# EAGLE design bot_power_supply (EAGLE 9.6.2)
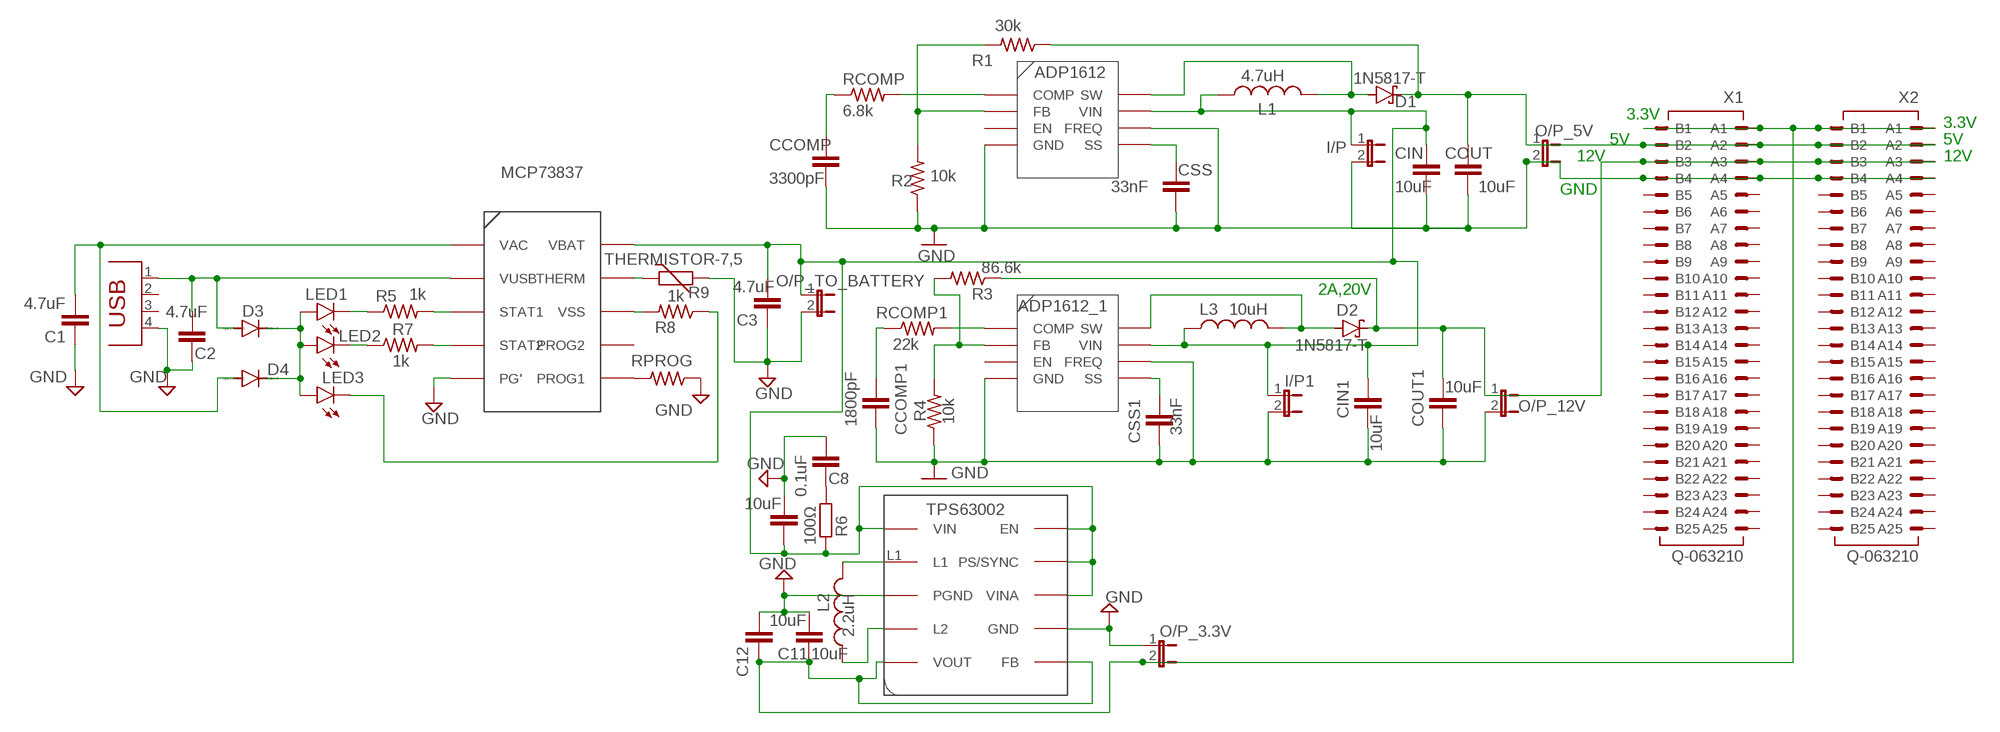
[diagram p0: schematic, sheet 1]

## Parts
ADP1612  ADP1612_DEV  [ADP1612_FOOT]
ADP1612_1  ADP1612_DEV  [ADP1612_FOOT]
C1  4.7uF  C2,5-3  [C2.5-3]
C2  4.7uF  C2,5-3  [C2.5-3]
C3  4.7uF  C2,5-3  [C2.5-3]
C8  0.1uF  C2.5/2  [C2.5-2]
C10  10uF  C2.5/2  [C2.5-2]
C11  10uF  C2.5/2  [C2.5-2]
C12  10uF  C2.5/2  [C2.5-2]
CCOMP  3300pF  C2,5-3  [C2.5-3]
CCOMP1  1800pF  C2,5-3  [C2.5-3]
CIN  10uF  C2,5-3  [C2.5-3]
CIN1  10uF  C2,5-3  [C2.5-3]
COUT  10uF  C2,5-3  [C2.5-3]
COUT1  10uF  C2,5-3  [C2.5-3]
CSS  33nF  C2,5-3  [C2.5-3]
CSS1  33nF  C2,5-3  [C2.5-3]
D1  1N5817-T  [DO41-7.6]
D2  1N5817-T  [DO41-7.6]
D3  1N4004  [DO41-10]
D4  1N4004  [DO41-10]
I/P  JP1E  [JP1]
I/P1  JP1E  [JP1]
L1  4.7uH  L-US0204/7  [0204/7]
L2  2.2uH  L-US0207/7  [0207/7]
L3  10uH  L-US0204/7  [0204/7]
LED1  LED3MM  [LED3MM]
LED2  LEDLD260  [LD260]
LED3  LED3MM  [LED3MM]
MCP73837  MCP73837-DEV  [MCP73837]
O/P_3.3V  JP1E  [JP1]
O/P_5V  JP1E  [JP1]
O/P_12V  JP1E  [JP1]
O/P_TO_BATTERY  JP1E  [JP1]
R1  30k  R-US_0204/2V  [0204V]
R2  10k  R-US_0204/2V  [0204V]
R3  86.6k  R-US_0204/2V  [0204V]
R4  10k  R-US_0204/2V  [0204V]
R5  1k  R-US_0204/2V  [0204V]
R6  100Ω  R-EU_0207/10  [0207/10]
R7  1k  R-US_0204/2V  [0204V]
R8  1k  R-US_0204/2V  [0204V]
R9  THERMISTOR-7,5  [R-7,5]
RCOMP  6.8k  R-US_0204/2V  [0204V]
RCOMP1  22k  R-US_0204/2V  [0204V]
RPROG  R-US_0204/2V  [0204V]
TPS63002  TPS63002  [TPS63002]
USB  PN61729  [PN61729]
X1  Q-063210  [063210]
X2  Q-063210  [063210]

## Nets
GND: ADP1612.FREQ ADP1612.GND ADP1612_1.FREQ ADP1612_1.GND C1.1 C2.1 C3.1 C8.2 C10.2 C11.2 C12.2 CCOMP1.2 CCOMP.2 CIN1.2 CIN.2 COUT1.2 COUT.2 CSS1.2 CSS.2 I/P1.2 I/P.2 MCP73837.PG' O/P_3.3V.1 O/P_5V.2 O/P_12V.2 O/P_TO_BATTERY.2 R2.1 R4.1 R9.2 RPROG.1 TPS63002.GND TPS63002.PGND USB.4 X1.A4 X1.B4 X2.A4 X2.B4
N$1: ADP1612.COMP RCOMP.2
N$2: CCOMP.1 RCOMP.1
N$3: COUT.1 D1.C O/P_5V.1 R1.1 X1.A2 X1.B2 X2.A2 X2.B2
N$4: ADP1612.FB R1.2 R2.2
N$5: L2.1 TPS63002.L1
N$6: ADP1612.SS CSS.1
N$7: ADP1612.SW D1.A L1.2
N$8: ADP1612_1.COMP RCOMP1.2
N$9: CCOMP1.1 RCOMP1.1
N$10: COUT1.1 D2.C O/P_12V.1 R3.1 X1.A3 X1.B3 X2.A3 X2.B3
N$11: L2.2 TPS63002.L2
N$12: ADP1612_1.FB R3.2 R4.2
N$13: ADP1612_1.SS CSS1.1
N$14: MCP73837.VSS R8.2
N$15: ADP1612_1.SW D2.A L3.2
N$16: MCP73837.STAT1 R5.2
N$17: MCP73837.STAT2 R7.2
N$19: ADP1612.VIN ADP1612_1.VIN C3.2 C10.1 CIN1.1 CIN.1 I/P1.1 I/P.1 L1.1 L3.1 MCP73837.VBAT O/P_TO_BATTERY.1 R6.1 TPS63002.EN TPS63002.PS/SYNC TPS63002.VIN TPS63002.VINA
N$20: C8.1 R6.2
N$22: MCP73837.PROG1 RPROG.2
N$23: MCP73837.THERM R9.1
N$24: C2.2 D3.A MCP73837.VUSB USB.1
N$25: LED1.K(C) R5.1
N$26: LED2.K(C) R7.1
N$27: D3.C D4.C LED1.A LED2.A LED3.A
N$28: C1.2 D4.A MCP73837.VAC
N$29: LED3.K(C) R8.1
N$30: C11.1 C12.1 O/P_3.3V.2 TPS63002.FB TPS63002.VOUT X1.A1 X1.B1 X2.A1 X2.B1
Unconnected: ADP1612.EN ADP1612_1.EN MCP73837.PROG2 USB.2 USB.3 X1.A5 X1.A6 X1.A7 X1.A8 X1.A9 X1.A10 X1.A11 X1.A12 X1.A13 X1.A14 X1.A15 X1.A16 X1.A17 X1.A18 X1.A19 X1.A20 X1.A21 X1.A22 X1.A23 X1.A24 X1.A25 X1.B5 X1.B6 X1.B7 X1.B8 X1.B9 X1.B10 X1.B11 X1.B12 X1.B13 X1.B14 X1.B15 X1.B16 X1.B17 X1.B18 X1.B19 X1.B20 X1.B21 X1.B22 X1.B23 X1.B24 X1.B25 X2.A5 X2.A6 X2.A7 X2.A8 X2.A9 X2.A10 X2.A11 X2.A12 X2.A13 X2.A14 X2.A15 X2.A16 X2.A17 X2.A18 X2.A19 X2.A20 X2.A21 X2.A22 X2.A23 X2.A24 X2.A25 X2.B5 X2.B6 X2.B7 X2.B8 X2.B9 X2.B10 X2.B11 X2.B12 X2.B13 X2.B14 X2.B15 X2.B16 X2.B17 X2.B18 X2.B19 X2.B20 X2.B21 X2.B22 X2.B23 X2.B24 X2.B25

## Notes on the sheet
- 3.3V
- 3.3V
- 5V | 5V
- 12V | 12V
- GND
- 2A,20V

## Library data of the parts
ADP1612 ADP1612_1 = ADP1612:ADP1612_DEV
C1-C3 C8 C10-C12 CCOMP CCOMP1 CIN CIN1 COUT COUT1 CSS CSS1 = capacitor-wima:C: CAPACITOR naming: grid - package width
D1 D2 = diode:1N581*: 1.0A SCHOTTKY BARRIER RECTIFIER Source: http://www.diodes.com/datasheets/ds23001.pdf
D3 D4 = diode:1N4004: DIODE general purpose rectifier, 1 A
I/P I/P1 O/P_3.3V O/P_5V O/P_12V O/P_TO_BATTERY = jumper:JP1E: JUMPER
L1-L3 = rcl:L-US: INDUCTOR, American symbol; SPICEPREFIX: L
LED1-LED3 = led:LED: LED OSRAM: - CHIPLED LG R971, LG N971, LY N971, LG Q971, LY Q971, LO R971, LY R971 LH N974, LH R974 LS Q976, LO Q976, LY Q976 LO Q996 - Hyper CHIPLED LW Q18S LB Q993, LB Q99A, LB R99A - SideLED LS A670, LO A670, LY A670, LG A670, LP A670 LB A673, LV A673, LT A673, LW A673 LH A674 LY A675 LS A676, LA A676, LO A676, LY A676, LW A676 LS A679, LY A679, LG A679 - Hyper Micro SIDELED® LS Y876, LA Y876, LO Y876, LY Y876 LT Y87S - SmartLED LW L88C, LW L88S LB L89C, LB L89S, LG L890 LS L89K, LO L89K, LY L89K LS L896, LA L896, LO L896, LY L896 - TOPLED LS T670, LO T670, LY T670, LG T670, LP T670 LSG T670, LSP T670, LSY T670, LOP T670, LYG T670 LG T671, LOG T671, LSG T671 LB T673, LV T673, LT T673, LW T673 LH T674 LS T676, LA T676, LO T676, LY T676, LB T676, LH T676, LSB T676, LW T676 LB T67C, LV T67C, LT T67C, LS T67K, LO T67K, LY T67K, LW E67C LS E67B, LA E67B, LO E67B, LY E67B, LB E67C, LV E67C, LT E67C LW T67C LS T679, LY T679, LG T679 LS T770, LO T770, LY T770, LG T770, LP T770 LB T773, LV T773, LT T773, LW T773 LH T774 LS E675, LA E675, LY E675, LS T675 LS T776, LA T776, LO T776, LY T776, LB T776 LHGB T686 LT T68C, LB T68C - Hyper Mini TOPLED® LB M676 - Mini TOPLED Santana® LG M470 LS M47K, LO M47K, LY M47K Source: http://www.osram.convergy.de LUXEON: - LUMILED® LXK2-PW12-R00, LXK2-PW12-S00, LXK2-PW14-U00, LXK2-PW14-V00 LXK2-PM12-R00, LXK2-PM12-S00, LXK2-PM14-U00 LXK2-PE12-Q00, LXK2-PE12-R00, LXK2-PE12-S00, LXK2-PE14-T00, LXK2-PE14-U00 LXK2-PB12-K00, LXK2-PB12-L00, LXK2-PB12-M00, LXK2-PB14-N00, LXK2-PB14-P00, LXK2-PB14-Q00 LXK2-PR12-L00, LXK2-PR12-M00, LXK2-PR14-Q00, LXK2-PR14-R00 LXK2-PD12-Q00, LXK2-PD12-R00, LXK2-PD12-S00 LXK2-PH12-R00, LXK2-PH12-S00 LXK2-PL12-P00, LXK2-PL12-Q00, LXK2-PL12-R00 Source: www.luxeon.com KINGBRIGHT: KA-3528ASYC Source: www.kingbright.com
MCP73837 = MCP73837:MCP73837-DEV
R1-R5 R7 R8 RCOMP RCOMP1 RPROG = rcl:R-US_: RESISTOR, American symbol; SPICEPREFIX: R
R6 = rcl:R-EU_: RESISTOR, European symbol; SPICEPREFIX: R
R9 = varistor:THERMISTOR: THERMISTOR
TPS63002 = TPS63002:TPS63002
USB = con-berg:PN61729: BERG USB connector; OC_FARNELL: unknown; OC_NEWARK: unknown
X1 X2 = con-erni:Q-063210: Male Connector SMC-Q 50 contacts Standard Assembly Height Source: http://www.erni.com/DB/PDF-Drawing/SMC/063210.pdf; OC_FARNELL: unknown; OC_NEWARK: unknown

## Board
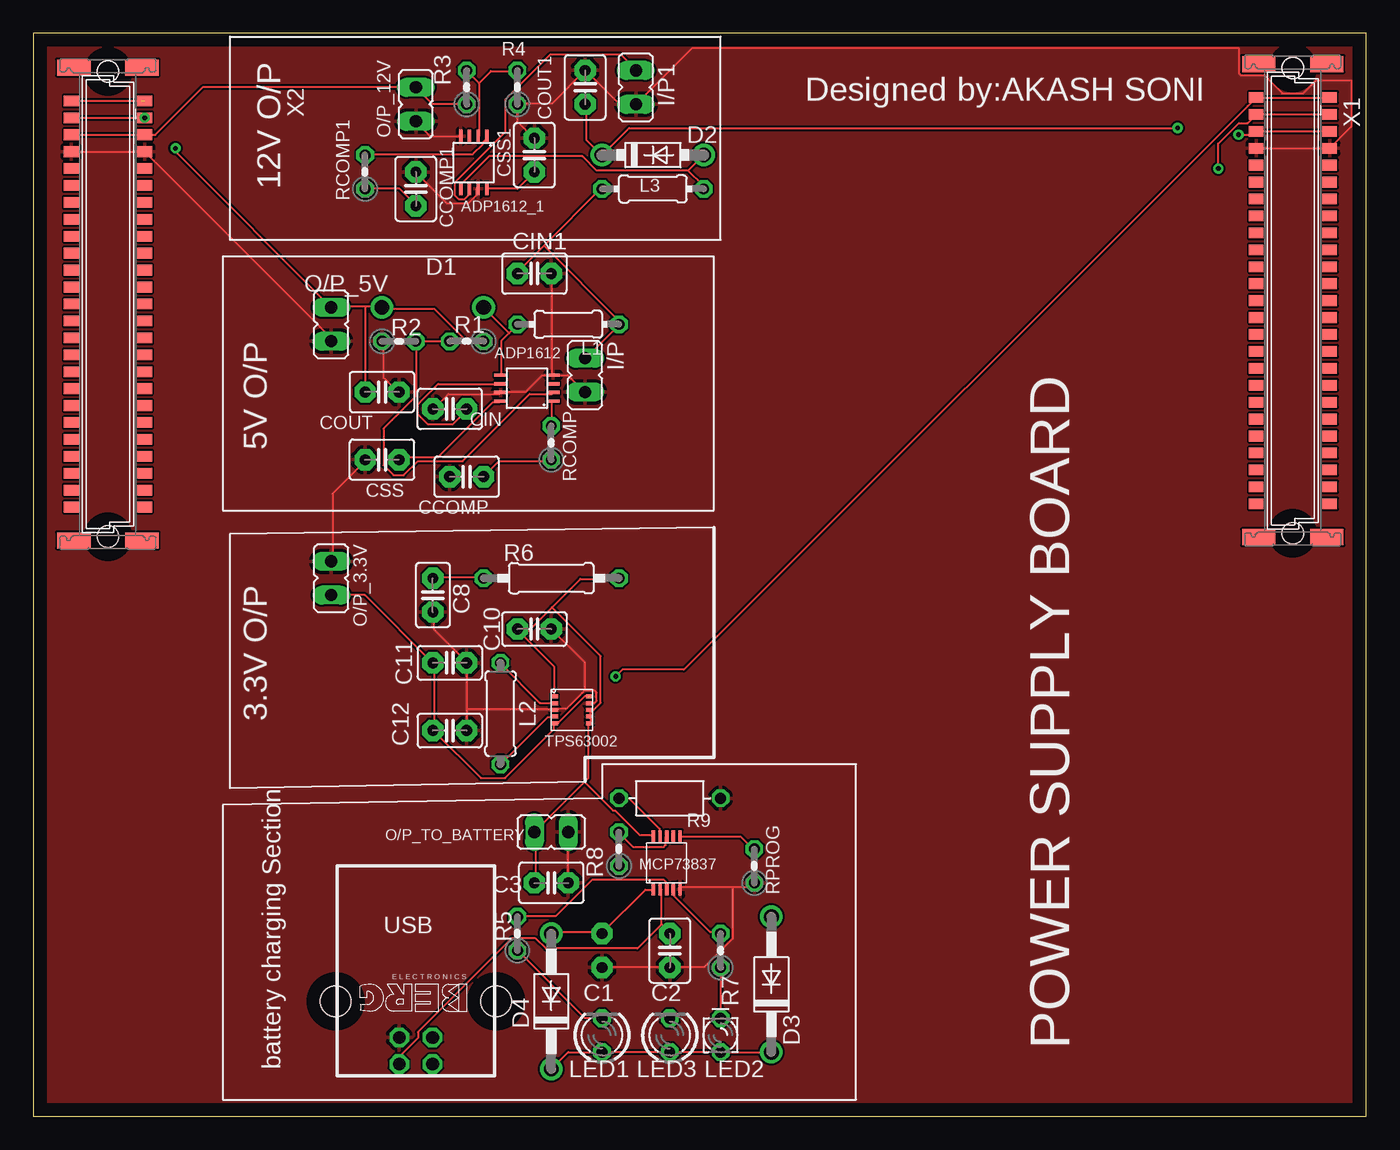
[diagram p1: board, top side]
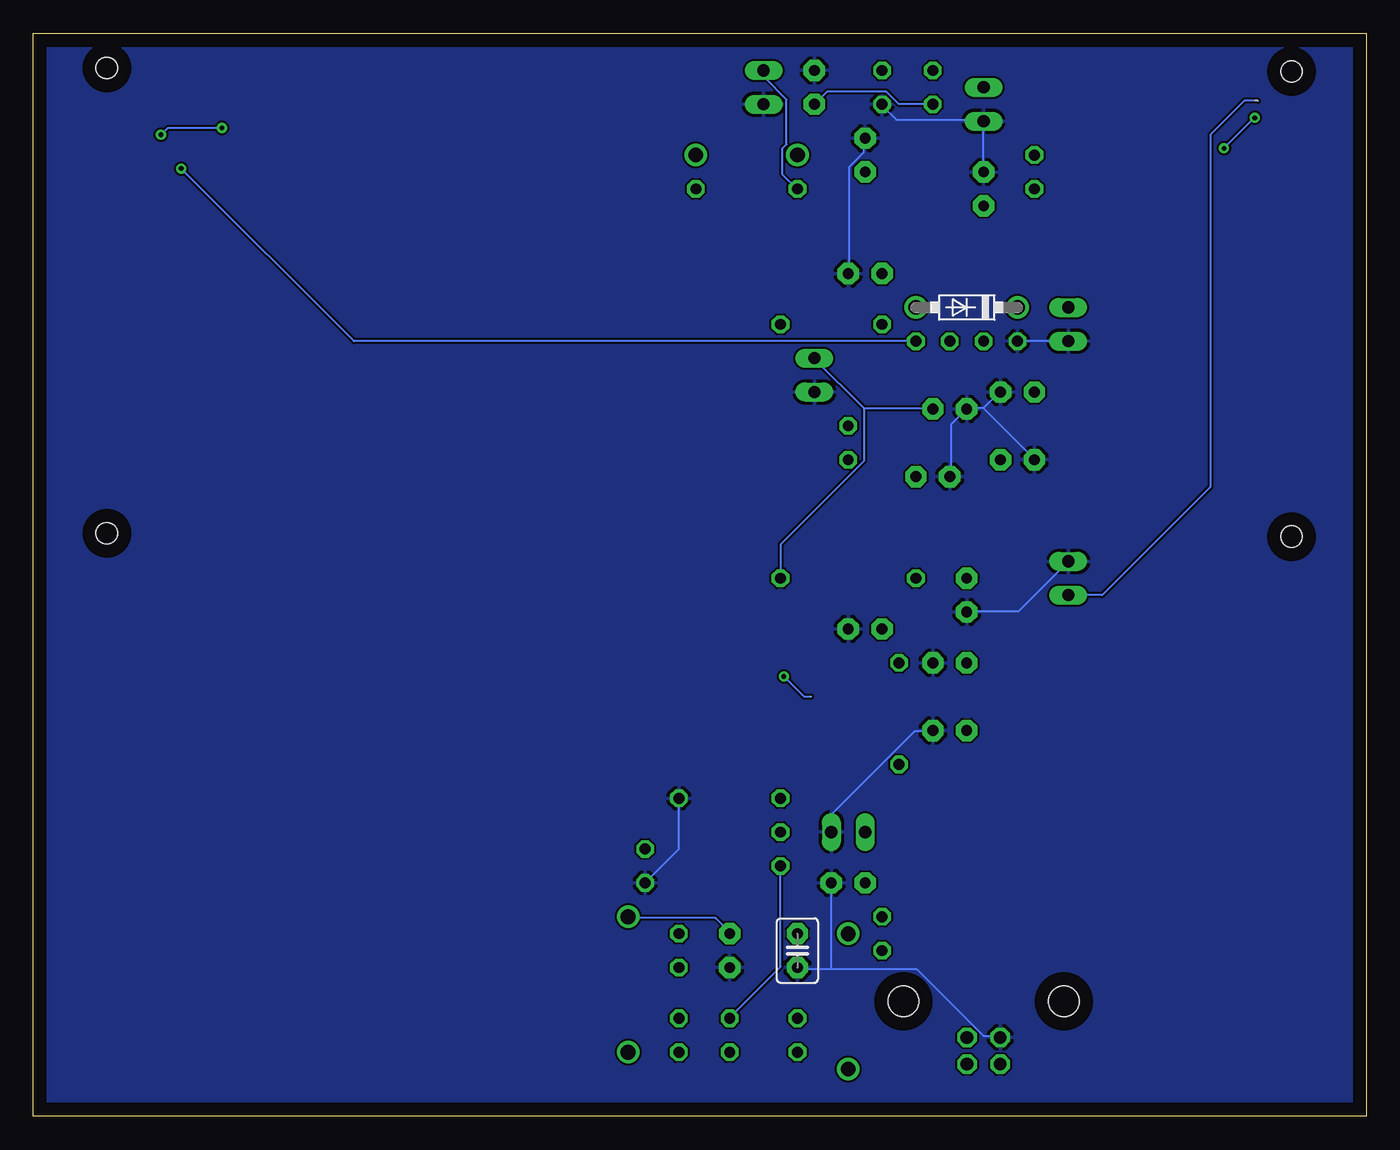
[diagram p2: board, bottom side, seen from below]

Size 100 x 81.27 mm. Coordinates in mm from the lower left corner, seen from the top.
Outline: 0,0 100,0 100,81.27 0,81.27 0,0
Copper layers (1*16): Top 0.035mm / dielectric 1.5mm / Bottom 0.035mm
Design rules "default": minimum track width 6mil, minimum drill 0.35mm, track to track 6mil, track to pad 6mil, pad to pad 6mil, via to via 6mil, smd to smd 6mil, copper to edge 40mil, drill to drill 6mil, minimum pad ring 10mil, minimum via ring 8mil, stop-mask expansion 4mil, vias tented up to drill 0mil, thermal gap 10mil

### Footprints (pad centres in the part's own frame; a part is rotated, then mirrored left to right if it is on the bottom)
ADP1612_FOOT = smd 0.95 x 0.25: COMP -0.475,2.475; EN -0.475,1.175; FB -0.475,1.825; FREQ 3.475,1.825; GND -0.475,0.525; SS 3.475,2.475; SW 3.475,0.525; VIN 3.475,1.175
C2.5-3 = drill 0.813 pad 1.6 octagon: 1 -1.27,0; 2 1.27,0
C2.5-2 = drill 0.813 pad 1.6 octagon: 1 -1.27,0; 2 1.27,0
DO41-7.6 = drill 1.1 pad 1.7: A 3.81,0; C -3.81,0
DO41-10 = drill 1.118: A 5.08,0; C -5.08,0
JP1 = drill 0.914 long: 1 0,-1.27; 2 0,1.27
0204/7 = drill 0.813 octagon: 1 -3.81,0; 2 3.81,0
0207/7 = drill 0.813 octagon: 1 -3.81,0; 2 3.81,0
LED3MM = drill 0.813 octagon: A -1.27,0; K 1.27,0
LD260 = drill 0.813 octagon: A -1.27,0; K 1.27,0
MCP73837 = smd 0.95 x 0.25: PG' -0.475,0.5; PROG1 3.475,0.5; PROG2 3.475,1; STAT1 -0.475,1.5; STAT2 -0.475,1; THERM 3.475,2; VAC -0.475,2.5; VBAT 3.475,2.5; VSS 3.475,1.5; VUSB -0.475,2
0204V = drill 0.813 octagon: 1 -1.27,0; 2 1.27,0
0207/10 = drill 0.813 octagon: 1 -5.08,0; 2 5.08,0
R-7,5 = drill 0.813 octagon: 1 -3.81,0; 2 3.81,0
TPS63002 = smd 0.5 x 0.3: EN 2.85,0.55; FB 2.85,2.55; GND 2.85,2.05; L1 0.25,2.05; L2 0.25,1.05; PGND 0.25,1.55; PS/SYNC 2.85,1.05; VIN 0.25,2.55; VINA 2.85,1.55; VOUT 0.25,0.55
PN61729 = drill 0.95 octagon: 1 1.25,4.71; 2 -1.25,4.71; 3 -1.25,2.71; 4 1.25,2.71 | hole 2.3: -6.02,0; 6.02,0
063210 = smd 0.8 x 1.1: A1 -15.24,2.765; A2 -13.97,2.765; A3 -12.7,2.765; A4 -11.43,2.765; A5 -10.16,2.765; A6 -8.89,2.765; A7 -7.62,2.765; A8 -6.35,2.765; A9 -5.08,2.765; A10 -3.81,2.765; A11 -2.54,2.765; A12 -1.27,2.765; A13 0,2.765; A14 1.27,2.765; A15 2.54,2.765; A16 3.81,2.765; A17 5.08,2.765; A18 6.35,2.765; A19 7.62,2.765; A20 8.89,2.765; A21 10.16,2.765; A22 11.43,2.765; A23 12.7,2.765; A24 13.97,2.765; A25 15.24,2.765; B1 -15.24,-2.74; B2 -13.97,-2.74; B3 -12.7,-2.74; B4 -11.43,-2.74; B5 -10.16,-2.74; B6 -8.89,-2.74; B7 -7.62,-2.74; B8 -6.35,-2.74; B9 -5.08,-2.74; B10 -3.81,-2.74; B11 -2.54,-2.74; B12 -1.27,-2.74; B13 0,-2.74; B14 1.27,-2.74; B15 2.54,-2.74; B16 3.81,-2.74; B17 5.08,-2.74; B18 6.35,-2.74; B19 7.62,-2.74; B20 8.89,-2.74; B21 10.16,-2.74; B22 11.43,-2.74; B23 12.7,-2.74; B24 13.97,-2.74; B25 15.24,-2.74 | smd 1.2 x 2.5: M1 -17.745,2.55; M2 -17.745,-2.55; M3 17.745,-2.55; M4 17.745,2.55 | hole 1.6: -17.45,0; 17.45,0

### Placement (x,y rotation side)
ADP1612  38.53,56.15 180 top
ADP1612_1  31.55,73.07 270 top
C1  42.67,12.45 90 bottom
C2  47.75,12.45 90 top
C3  38.86,17.53 180 top
C8  29.97,39.12 270 top
C10  37.59,36.58 0 top
C11  31.24,34.04 0 top
C12  31.24,28.96 0 top
CCOMP  32.51,48.01 180 top
CCOMP1  28.7,69.6 90 top
CIN  31.24,53.09 180 top
CIN1  37.59,63.25 0 top
COUT  26.16,54.36 0 top
COUT1  41.4,77.22 90 top
CSS  26.16,49.28 180 top
CSS1  37.59,72.14 90 top
D1  29.97,60.71 180 bottom
D2  46.48,72.14 0 top
D3  55.37,9.91 90 top
D4  38.86,8.64 90 top
I/P  41.4,55.63 180 top
I/P1  45.21,77.22 180 top
L1  40.13,59.44 180 top
L2  35.05,30.23 270 top
L3  46.48,69.6 0 top
LED1  42.67,6.1 90 top
LED2  51.56,6.1 90 top
LED3  47.75,6.1 90 top
MCP73837  49.02,17.53 90 top
O/P_3.3V  22.35,40.39 180 top
O/P_5V  22.35,59.44 180 top
O/P_12V  28.7,75.95 180 top
O/P_TO_BATTERY  38.86,21.34 270 top
R1  32.51,58.17 180 top
R2  27.43,58.17 0 top
R3  32.51,77.22 90 top
R4  36.32,77.22 90 top
R5  36.32,13.72 90 top
R6  38.86,40.39 180 top
R7  51.56,12.45 90 top
R8  43.94,20.07 90 top
R9  47.75,23.88 0 top
RCOMP  38.86,50.55 90 top
RCOMP1  24.89,70.87 90 top
RPROG  54.1,18.8 90 top
TPS63002  38.86,28.96 0 top
USB  28.7,8.64 180 top
X1  94.49,61.21 270 top
X2  5.59,60.96 270 top

### Tracks (layer width: path | path; a pad name or v marks a point on that pad's centre or on a via)
GND
  Top 0.152: 52.48,17.17 53.7,17.17 54,17.48 RPROG.1 | 52.48,17.17 48.51,17.17 MCP73837.PG' | C3.1 O/P_TO_BATTERY.2 | 47.75,11.23 42.72,11.23 C1.1 | 52.48,17.17 52.48,13.36 50.34,11.23 47.75,11.23 | 47.75,11.23 C2.1 | ADP1612_1.GND 32.05,73.56 29.77,73.56 28.7,74.62 O/P_12V.2 | ADP1612_1.FREQ 33.27,69.6 33.27,69.14 32.66,68.53 30.99,68.53 28.7,70.81 CCOMP1.2 | CSS1.2 37.54,73.41 36.32,74.62 R4.1 36.32,76 38.91,76 COUT1.2 41.5,78.44 43.94,76 45.16,76 I/P1.2 49.44,80.18 90.42,80.18 90.46,80.14 90.46,78.26 90.59,78.13 92.35,78.13 93.7,76.77 95.27,76.77 96.22,77.72 98.91,77.72 98.91,74.3 X1.A4 X1.B4 | 41.35,31.95 39.98,30.58 39.22,30.58 TPS63002.PGND 39.06,30.58 32.51,30.58 | 41.35,31.95 42.11,31.95 42.27,31.8 42.27,31.19 42.11,31.04 41.81,31.04 TPS63002.GND | 41.35,31.95 41.35,34.09 C10.2 | C8.2 30.07,37.74 30.07,36.52 32.51,34.09 C11.2 32.51,30.58 | 32.51,30.58 C12.2 | ADP1612.GND 38.91,55.58 38.15,55.58 36.93,54.36 35.1,54.36 ADP1612.FREQ 34.95,54.2 31.14,54.2 30.07,53.14 CIN.2 | ADP1612.GND 39.06,55.58 40.13,55.58 41.35,54.36 I/P.2 | CIN1.2 38.91,63.2 38.91,55.73 ADP1612.GND | O/P_3.3V.1 22.45,41.71 22.45,46.74 24.89,49.17 CSS.2 | R2.1 26.26,58.17 26.26,55.42 27.33,54.36 COUT.2 | X2.B4 X2.A4 8.99,71.75 9,71.75 22.35,58.39 O/P_5V.2
  Bottom 0.152: R9.2 51.56,20.07 RPROG.1 | 40.13,11.07 42.57,11.07 C1.1 | 40.13,11.07 33.73,11.07 28.7,6.04 27.48,6.04 USB.4 | 40.13,11.07 C3.1 | CCOMP1.2 O/P_12V.2 28.7,74.78 35.26,74.78 36.32,75.84 R4.1 | O/P_5V.2 R2.1 | 28.7,53.14 29.92,53.14 CIN.2 31.14,51.92 31.14,48.11 CCOMP.2 | 28.7,53.14 27.48,54.36 COUT.2 | 28.7,53.14 24.89,49.33 CSS.2 | O/P_3.3V.1 26.11,37.9 29.92,37.9 C8.2 | CSS1.2 37.69,73.41 37.69,72.34 38.76,71.27 38.76,63.35 CIN1.2 | O/P_TO_BATTERY.2 40.13,22.66 33.88,28.91 32.51,28.91 C12.2
  pour Top: -0.51,81.79 -0.51,-0.51 100.58,-0.51 100.58,81.79
  pour Bottom: -1.02,82.3 -1.02,-1.02 101.09,-1.02 101.09,82.3
N$1
  Top 0.152: ADP1612.COMP 38.91,53.59 38.91,51.92 RCOMP.2
N$2
  Top 0.152: CCOMP.1 34.95,49.17 38.76,49.17 RCOMP.1
N$3  (via drill 0.35)
  Top 0.152: R1.1 32.51,58.17 30.07,60.6 26.26,60.6 D1.C 26.11,60.76 24.89,60.76 | 24.89,60.76 22.45,60.76 O/P_5V.1 10.67,72.39 v10.67,72.64 | 24.89,60.76 COUT.1 | X2.B2 7.87,74.93 8.13,75.18 8.35,74.96 X2.A2 | X1.A2 X1.B2 91.11,74.54 90.45,74.54 88.9,72.99 v88.9,71.12
  Bottom 0.152: v10.67,72.64 8.38,74.93 X2.A2 | R1.1 75.95,58.17 v88.9,71.12
  other vias: 8.35,74.93
N$4
  Top 0.152: ADP1612.FB 38.91,54.2 37.24,54.2 32.21,49.17 28.85,49.17 27.79,48.11 27.03,48.11 26.26,48.87 26.26,51.61 28.7,54.05 R2.2 R1.2
N$5
  Top 0.152: TPS63002.L1 39.06,31.04 38,31.04 35.1,33.93 L2.1
N$6
  Top 0.152: CSS.1 27.64,49.48 30.38,49.48 34.49,53.59 34.95,53.59 ADP1612.SS
N$7
  Top 0.152: 35.71,58.78 36.32,59.38 L1.2 | 35.71,58.78 35.1,58.17 35.1,55.73 ADP1612.SW | 35.71,58.78 D1.A
N$8
  Top 0.152: ADP1612_1.COMP 34.04,73.41 33.73,73.1 33.73,72.95 32.97,72.19 24.89,72.19 RCOMP1.2
N$9
  Top 0.152: RCOMP1.1 27.48,69.6 28.7,68.38 CCOMP1.1
N$10  (via drill 0.35)
  Top 0.152: R3.1 32.51,76 29.92,76 O/P_12V.1 12.7,77.22 9.14,73.66 X2.A3 X2.B3 | COUT1.1 41.5,75.84 41.5,73.25 42.57,72.19 D2.C 44.7,74.17 v85.85,74.17 | X1.A3 X1.B3 91.49,73.66 v90.42,73.66
  Bottom 0.152: COUT1.1 40.44,76.91 36.02,76.91 35.1,76 32.51,76 R3.1 | v85.85,74.17 89.92,74.17 v90.42,73.66
N$11
  Top 0.152: L2.2 38.61,29.97 39.06,29.97 TPS63002.L2
N$12
  Top 0.152: 33.43,77.52 33.43,73.56 ADP1612_1.FB | 33.43,77.52 32.51,78.44 R3.2 | 33.43,77.52 34.34,78.44 36.32,78.44 R4.2
N$13
  Top 0.152: ADP1612_1.SS 36.32,69.6 CSS1.1
N$14
  Top 0.152: MCP73837.VSS 47.45,20.98 47.45,20.37 47.3,20.22 45.01,20.22 43.94,21.29 R8.2
N$15
  Top 0.152: 49.12,70.97 42.27,70.97 41.2,72.03 34.19,72.03 32.05,69.9 32.05,69.6 ADP1612_1.SW | D2.A 49.12,70.97 | 49.12,70.97 50.19,69.9 50.19,69.6 L3.2
N$16
  Top 0.152: MCP73837.STAT1 47.45,17.17 47.45,17.63 47.3,17.78 41.96,17.78 39.22,15.04 36.32,15.04 R5.2
N$17
  Top 0.152: MCP73837.STAT2 48.06,17.02 48.06,16.56 50.8,13.82 51.56,13.82 R7.2
N$19
  Top 0.152: 36.78,36.07 36.32,36.52 C10.1 36.78,36.07 | 36.78,36.07 39.06,33.78 39.06,31.65 TPS63002.VIN | 36.78,36.07 38.91,38.2 | 38.91,38.2 41.05,40.34 43.94,40.34 R6.1 | 41.81,30.28 41.81,30.12 TPS63002.PS/SYNC 41.81,29.97 41.81,29.52 TPS63002.EN 41.66,29.36 41.66,25.4 41.35,25.09 | 41.81,30.28 41.81,30.43 TPS63002.VINA | 41.35,25.09 O/P_TO_BATTERY.1 37.69,21.29 37.69,17.63 C3.2 | 41.35,25.09 43.48,22.96 43.64,22.96 45.47,21.13 46.53,21.13 MCP73837.VBAT | 38.91,38.2 42.57,34.54 42.57,31.04 41.81,30.28 | ADP1612_1.VIN 32.66,69.6 32.66,69.14 32.36,68.83 31.9,68.83 31.6,69.14 31.6,70.05 35.41,73.86 35.41,76.3 38.76,79.65 44.09,79.65 45.16,78.59 I/P1.1 | 38.3,65.33 36.32,63.35 CIN1.1 | 38.3,65.33 42.57,69.6 L3.1 | ADP1612.VIN 34.95,54.97 30.38,54.97 28.85,53.44 28.85,52.68 29.62,51.92 31.45,51.92 32.51,52.98 CIN.1 | I/P.1 41.5,56.95 43.94,59.38 L1.1 43.94,59.69 38.3,65.33
  Bottom 0.152: 37.69,53.14 32.51,53.14 CIN.1 | 37.69,53.14 41.35,56.79 I/P.1 | I/P1.1 45.16,78.44 45.16,77.98 43.48,76.3 43.48,72.95 43.79,72.64 43.79,70.66 42.72,69.6 L3.1 | R6.1 43.94,42.93 37.69,49.17 37.69,53.14
N$20
  Top 0.152: R6.2 33.73,40.49 30.07,40.49 C8.1
N$22
  Top 0.152: MCP73837.PROG1 48.51,20.98 53.09,20.98 54,20.07 RPROG.2
N$23
  Top 0.152: R9.1 44.7,23.88 46.99,21.59 46.99,21.13 MCP73837.THERM
N$24
  Top 0.152: 47.14,14.43 47.14,17.02 MCP73837.VUSB | 47.14,14.43 47.75,13.82 C2.2 | 47.14,14.43 45.31,12.6 38.46,12.6 37.69,13.36 35.87,13.36 28.85,6.35 28.85,5.89 27.48,4.52 27.48,4.06 USB.1
  Bottom 0.152: D3.A 55.37,14.88 48.82,14.88 47.75,13.82 C2.2
N$25
  Top 0.152: R5.1 41.35,7.42 42.57,7.42 LED1.K
N$26
  Top 0.152: R7.1 LED2.K
N$27
  Top 0.152: D4.C 40.13,4.83 LED1.A LED3.A LED2.A D3.C
N$28
  Top 0.152: MCP73837.VAC 46.53,17.02 45.92,17.02 42.72,13.82 C1.2 42.57,13.82 38.91,13.82 D4.A
N$29
  Bottom 0.152: R8.1 43.94,11.23 47.75,7.42 LED3.K
N$30  (via drill 0.35)  (2 unrouted)
  Top 0.152: TPS63002.FB 41.66,31.5 41.35,31.5 39.37,29.52 39.22,29.52 TPS63002.VOUT 39.06,29.36 39.06,29.06 35.41,25.4 33.58,25.4 30.07,28.91 C12.1 30.07,29.06 30.07,33.93 C11.1 24.89,39.12 O/P_3.3V.2 | X2.B1 X2.A1 | X1.A1 X1.B1 91.11,75.81 91.1,75.81 48.82,33.53 44.2,33.53 v43.69,33.02
  Bottom 0.152: 8.13,76.2 9.14,76.2 11.68,73.66 11.68,47.24 19.81,39.12 O/P_3.3V.2 | v43.69,33.02 42.16,31.5 41.66,31.5

### Text on the board
tPlace: Designed by:AKASH SONI | 12V O/P | 5V O/P | 3.3V O/P | POWER SUPPLY BOARD | battery charging Section